# EAGLE design Down Linker ver1.0.0 (EAGLE 9.6.2)
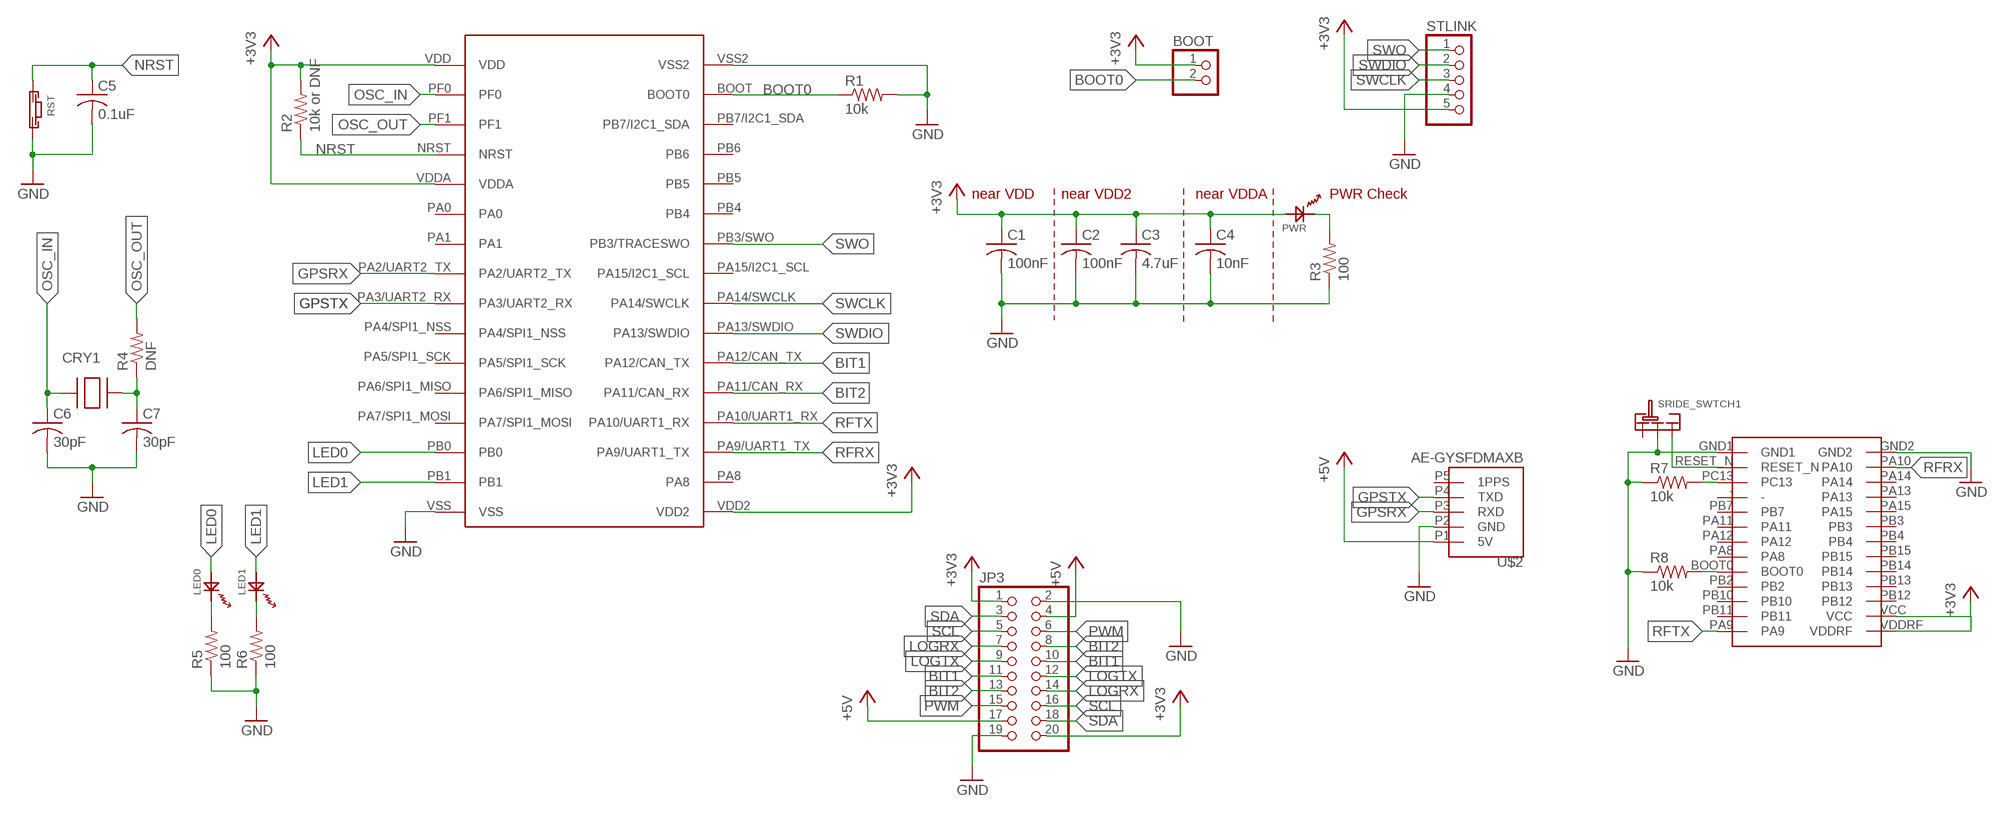
[diagram p0: schematic, sheet 1]

## Parts
BOOT  PINHD-1X2/90  [1X02/90]
C1  100nF  C-USC1608  [C1608]
C2  100nF  C-USC1608  [C1608]
C3  4.7uF  C-USC1608  [C1608]
C4  10nF  C-USC1608  [C1608]
C5  0.1uF  C-USC1608  [C1608]
C6  30pF  C-USC1608  [C1608]
C7  30pF  C-USC1608  [C1608]
CRY1  8MHZ  [CRYSTAL]
JP3  PINHD-2X10/90  [2X10/90]
LED0  OSXX1608C1A  [OSXX1608C1A]
LED1  OSXX1608C1A  [OSXX1608C1A]
PWR  OSXX1608C1A  [OSXX1608C1A]
R1  10k  R-US_R0603  [R0603]
R2  10k or DNF  R-US_R0603  [R0603]
R3  100  R-US_R0603  [R0603]
R4  DNF  R-US_R0603  [R0603]
R5  100  R-US_R0603  [R0603]
R6  100  R-US_R0603  [R0603]
R7  10k  R-US_R0603  [R0603]
R8  10k  R-US_R0603  [R0603]
RST  TVAF06-A020B-R  [TVAF06-A020B-R]
SRIDE_SWTCH1  SRIDE_SWITCH  [SRIDE_SWITCH]
STLINK  PINHD-1X5/90  [1X05/90]
U$1  STM32F303K8  [STM32F303K8]
U$2  AE-GYSFDMAXB  [AE-GYSFDMAXB]
U$3  RM-92A  [RM-92A]

## Nets
+3V3: BOOT.1 C1.1 C2.1 C3.1 C4.1 JP3.1 JP3.20 PWR.AN R2.2 STLINK.5 U$1.VDD U$1.VDD2 U$1.VDDA U$3.VCC U$3.VDDRF
+5V: JP3.4 JP3.17 U$2.P1(5V)
BIT1: JP3.10 JP3.11 U$1.PA12/CAN_TX
BIT2: JP3.8 JP3.13 U$1.PA11/CAN_RX
BOOT0: BOOT.2 R1.1 U$1.BOOT(BOOT0)
GND: C1.2 C2.2 C3.2 C4.2 C5.2 C6.2 C7.2 JP3.2 JP3.19 R1.2 R3.1 R5.1 R6.1 R7.1 R8.1 RST.P$2 SRIDE_SWTCH1.LR STLINK.4 U$1.VSS U$1.VSS2 U$2.P2(GND) U$3.GND1 U$3.GND2
GPSRX: U$1.PA2/UART2_TX U$2.P3(RXD)
GPSTX: U$1.PA3/UART2_RX U$2.P4(TXD)
LED0: LED0.AN U$1.PB0
LED1: LED1.AN U$1.PB1
LOGRX: JP3.7 JP3.14
LOGTX: JP3.9 JP3.12
N$1: PWR.CT R3.2
N$2: LED0.CT R5.2
N$3: C7.1 CRY1.P$2 R4.1
N$4: LED1.CT R6.2
N$6: SRIDE_SWTCH1.R U$3.RESET_N
N$9: R7.2 U$3.PC13
N$10: R8.2 U$3.BOOT0
NRST: C5.1 R2.1 RST.P$1 U$1.NRST
OSC_IN: C6.1 CRY1.P$1 U$1.PF0
OSC_OUT: R4.2 U$1.PF1
PWM: JP3.6 JP3.15
RFRX: U$1.PA9/UART1_TX U$3.PA10
RFTX: U$1.PA10/UART1_RX U$3.PA9
SCL: JP3.5 JP3.16
SDA: JP3.3 JP3.18
SWCLK: STLINK.3 U$1.PA14/SWCLK
SWDIO: STLINK.2 U$1.PA13/SWDIO
SWO: STLINK.1 U$1.PB3/SWO(PB3/TRACESWO)
Unconnected: SRIDE_SWTCH1.L U$1.PA0 U$1.PA1 U$1.PA4/SPI1_NSS U$1.PA5/SPI1_SCK U$1.PA6/SPI1_MISO U$1.PA7/SPI1_MOSI U$1.PA8 U$1.PA15/I2C1_SCL U$1.PB4 U$1.PB5 U$1.PB6 U$1.PB7/I2C1_SDA U$2.P5(1PPS) U$3.- U$3.PA8 U$3.PA11 U$3.PA12 U$3.PA13 U$3.PA14 U$3.PA15 U$3.PB2 U$3.PB3 U$3.PB4 U$3.PB7 U$3.PB10 U$3.PB11 U$3.PB12 U$3.PB13 U$3.PB14 U$3.PB15

## Notes on the sheet
- near VDD | near VDD2 | near VDDA | PWR Check

## Library data of the parts
BOOT = pinhead:PINHD-1X2: PIN HEADER
C1-C7 = rcl:C-US: CAPACITOR, American symbol; SPICEPREFIX: C
CRY1 = Crystal:8MHZ
JP3 = pinhead:PINHD-2X10: PIN HEADER
LED0 LED1 PWR = Chip LED:OSXX1608C1A
R1-R8 = rcl:R-US_: RESISTOR, American symbol; SPICEPREFIX: R
RST = Tact switch:TVAF06-A020B-R
SRIDE_SWTCH1 = Sride Switch:SRIDE_SWITCH
STLINK = pinhead:PINHD-1X5: PIN HEADER
U$1 = STM32F303K8:STM32F303K8
U$2 = AE-GYSFDMAXB:AE-GYSFDMAXB
U$3 = RM-92A:RM-92A

## Board
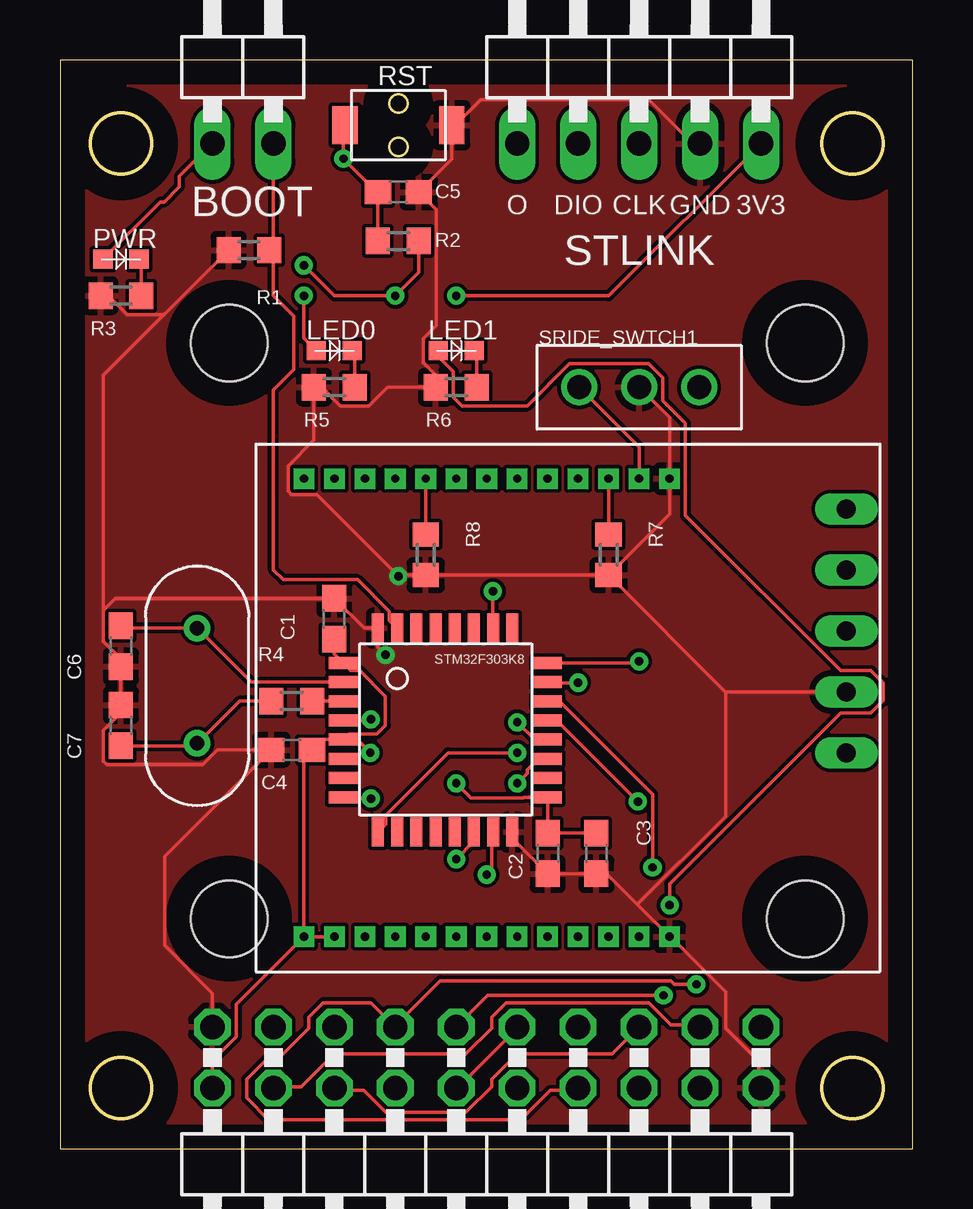
[diagram p1: board, top side]
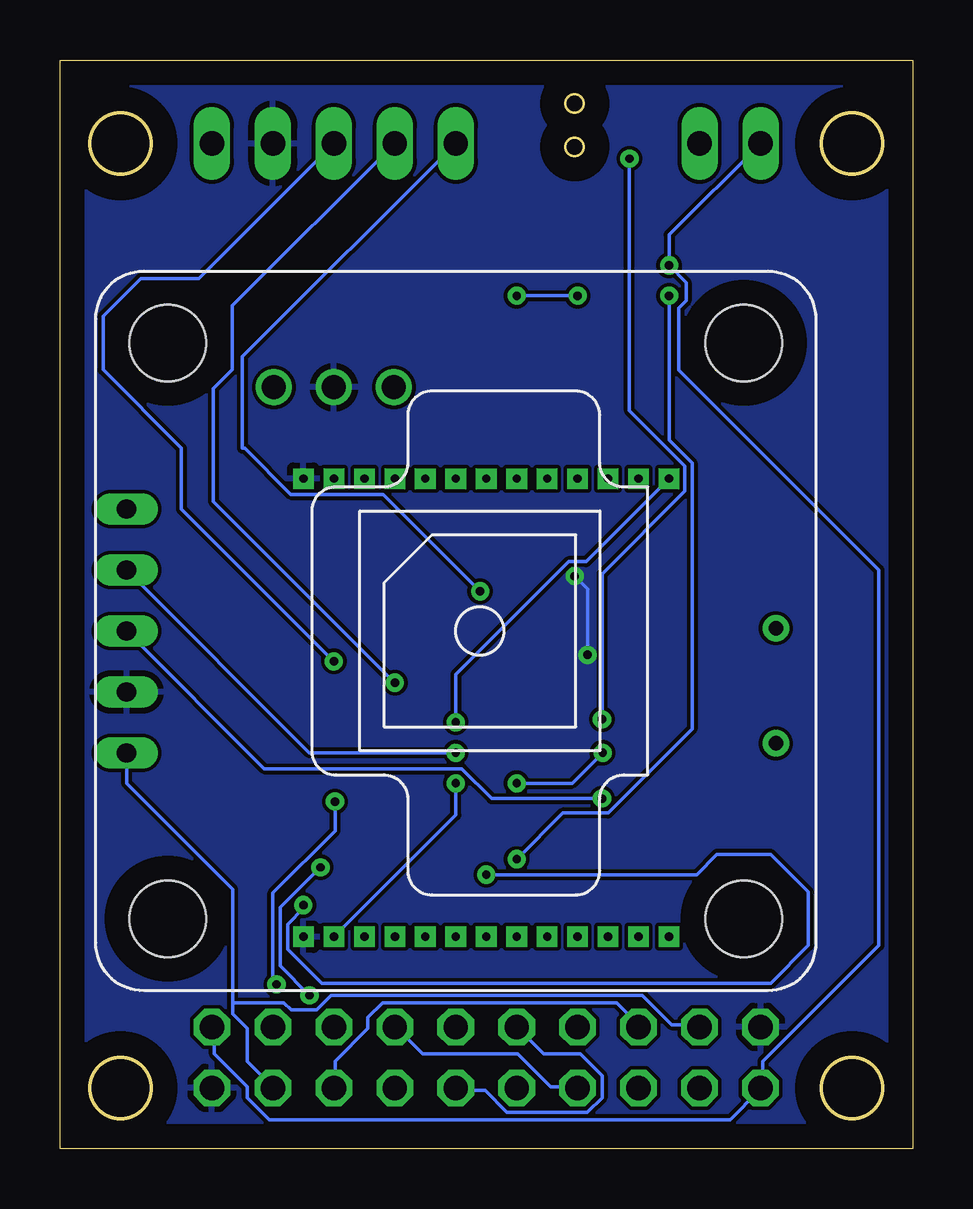
[diagram p2: board, bottom side, seen from below]

Size 35.54 x 45.39 mm. Coordinates in mm from the lower left corner, seen from the top.
Outline: 0,0 35.54,0 35.54,45.39 0,45.39 0,0
Outline: circle at 2.54,2.54 radius 1.27
Outline: circle at 33.02,2.54 radius 1.27
Outline: circle at 33.02,41.91 radius 1.27
Outline: circle at 2.54,41.91 radius 1.27
Copper layers (1*16): Top 0.035mm / dielectric 1.5mm / Bottom 0.035mm
Design rules "default": minimum track width 6mil, minimum drill 0.35mm, track to track 6mil, track to pad 6mil, pad to pad 6mil, via to via 6mil, smd to smd 6mil, copper to edge 40mil, drill to drill 6mil, minimum pad ring 10mil, minimum via ring 8mil, stop-mask expansion 4mil, vias tented up to drill 0mil, thermal gap 10mil

### Footprints (pad centres in the part's own frame; a part is rotated, then mirrored left to right if it is on the bottom)
1X02/90 = drill 1.016 long: 1 -1.27,-3.81; 2 1.27,-3.81
C1608 = smd 1.1 x 1: 1 -0.85,0; 2 0.85,0
CRYSTAL = drill 0.6: P$1 2.4,0; P$2 -2.4,0
2X10/90 = drill 1.016 octagon: 1 -11.43,-6.35; 2 -11.43,-3.81; 3 -8.89,-6.35; 4 -8.89,-3.81; 5 -6.35,-6.35; 6 -6.35,-3.81; 7 -3.81,-6.35; 8 -3.81,-3.81; 9 -1.27,-6.35; 10 -1.27,-3.81; 11 1.27,-6.35; 12 1.27,-3.81; 13 3.81,-6.35; 14 3.81,-3.81; 15 6.35,-6.35; 16 6.35,-3.81; 17 8.89,-6.35; 18 8.89,-3.81; 19 11.43,-6.35; 20 11.43,-3.81
OSXX1608C1A = smd 0.8 x 0.8: AN -0.75,0; CT 0.75,0
R0603 = smd 1 x 1.1: 1 -0.85,0; 2 0.85,0
TVAF06-A020B-R = smd 1.6 x 1.05: P$1 0,2.225; P$2 0,-2.225
SRIDE_SWITCH = drill 1: L -2.5,0; LR 0,0; R 2.5,0
1X05/90 = drill 1.016 long: 1 -5.08,-3.81; 2 -2.54,-3.81; 3 0,-3.81; 4 2.54,-3.81; 5 5.08,-3.81
STM32F303K8 = smd 0.5 x 1.2: BOOT 1.6,8.5; PA3/UART2_RX 0.8,0; PA4/SPI1_NSS 1.6,0; PA5/SPI1_SCK 2.4,0; PA6/SPI1_MISO 3.2,0; PA7/SPI1_MOSI 4,0; PA15/I2C1_SCL 6.4,8.5; PB0 4.8,0; PB1 5.6,0; PB3/SWO 5.6,8.5; PB4 4.8,8.5; PB5 4,8.5; PB6 3.2,8.5; PB7/I2C1_SDA 2.4,8.5; VSS 0.8,8.5; VSS2 6.4,0 | smd 1.2 x 0.5: NRST -0.65,4.65; PA0 -0.65,3.05; PA1 -0.65,2.25; PA2/UART2_TX -0.65,1.45; PA8 7.85,2.25; PA9/UART1_TX 7.85,3.05; PA10/UART1_RX 7.85,3.85; PA11/CAN_RX 7.85,4.65; PA12/CAN_TX 7.85,5.45; PA13/SWDIO 7.85,6.25; PA14/SWCLK 7.85,7.05; PF0 -0.65,6.25; PF1 -0.65,5.45; VDD -0.65,7.05; VDD2 7.85,1.45; VDDA -0.65,3.85
AE-GYSFDMAXB = drill 0.8 long: P1 13.716,5.08; P2 13.716,2.54; P3 13.716,0; P4 13.716,-2.54; P5 13.716,-5.08 | hole 3.2: -12,12; 12,12; 12,-12; -12,-12
RM-92A = drill 0.35 square: - 0,11.43; BOOT0 0,5.08; GND1 0,15.24; GND2 19.1,15.24; PA8 0,6.35; PA9 0,0; PA10 19.1,13.97; PA11 0,8.89; PA12 0,7.62; PA13 19.1,11.43; PA14 19.1,12.7; PA15 19.1,10.16; PB2 0,3.81; PB3 19.1,8.89; PB4 19.1,7.62; PB7 0,10.16; PB10 0,2.54; PB11 0,1.27; PB12 19.1,2.54; PB13 19.1,3.81; PB14 19.1,5.08; PB15 19.1,6.35; PC13 0,12.7; RESET_N 0,13.97; VCC 19.1,1.27; VDDRF 19.1,0

### Placement (x,y rotation side)
BOOT  7.62,45.72 0 top
C1  11.43,22.1 90 top
C2  20.32,12.32 270 top
C3  22.35,12.32 270 top
C4  9.65,16.64 180 top
C5  14.1,39.88 0 top
C6  2.54,20.95 270 top
C7  2.54,17.65 90 top
CRY1  5.71,19.3 90 top
JP3  17.78,-1.27 180 top
LED0  11.43,33.27 0 top
LED1  16.51,33.27 0 top
PWR  2.54,37.08 0 top
R1  7.87,37.47 180 top
R2  14.1,37.85 0 top
R3  2.54,35.56 0 top
R4  9.65,18.67 0 top
R5  11.43,31.75 0 top
R6  16.51,31.75 0 top
R7  22.86,24.77 90 top
R8  15.24,24.77 90 top
RST  14.1,42.67 90 top
SRIDE_SWTCH1  24.13,31.75 180 top
STLINK  24.13,45.72 0 top
U$1  12.45,13.21 0 top
U$2  19.05,21.59 180 bottom
U$3  10.16,27.94 270 top

### Tracks (layer width: path | path; a pad name or v marks a point on that pad's centre or on a via)
+3V3  (via drill 0.35)
  Top 0.152: U$1.VDDA 10.92,17.06 C4.1 10.16,16.3 U$3.VDDRF | BOOT.1 4.98,40.54 4.98,40.11 4.34,39.47 4.18,39.47 PWR.AN | U$1.VDDA 12.04,17.3 13.21,17.3 13.56,17.66 13.56,18.87 12.49,19.94 12.12,19.94 U$1.VDD 11.43,20.62 C1.1 | C3.1 C2.1 20.32,14.63 U$1.VDD2 19.33,14.66 19.3,14.63 17.12,14.63 v16.51,15.24 | U$3.VDDRF U$3.VCC | U$3.VDDRF 7.34,6.02 7.34,4.67 6.35,3.68 JP3.20 | v10.16,36.83 11.43,35.56 v13.97,35.56 14.95,36.54 R2.2 | STLINK.5 22.86,35.56 v16.51,35.56 | v12.93,16.51 12.38,17.06 U$1.VDDA
  Bottom 0.152: v16.51,15.24 14.2,15.24 v12.93,16.51 | BOOT.1 10.16,38.1 v10.16,36.83 9.45,36.12 9.45,35.36 9.75,35.05 9.75,32.46 1.42,24.13 1.42,8.48 6.25,3.66 6.25,2.59 JP3.20 6.4,2.44 7.62,1.22 26.82,1.22 27.74,2.13 27.74,2.59 29.11,3.96 29.11,5.03 JP3.1 | v16.51,35.56 v13.97,35.56
+5V
  Bottom 0.152: U$2.P1 32.77,15.24 28.35,10.82 28.35,6.1 | 28.35,6.1 28.35,5.64 27.74,5.03 27.74,3.66 26.67,2.59 JP3.4 | 28.35,6.1 26.21,6.1 25.91,5.79 24.84,5.79 24.23,6.4 11.28,6.4 10.06,5.18 8.99,5.18 JP3.17
BIT1  (via drill 0.35)
  Top 0.152: v24.69,11.73 24.69,14.78 20.88,18.59 20.42,18.59 U$1.PA12/CAN_TX | v25.15,6.4 17.83,6.4 JP3.11
  Bottom 0.152: v24.69,11.73 26.36,10.06 26.36,7.62 v25.15,6.4 | JP3.11 15.39,3.96 13.87,3.96 12.95,3.05 12.95,2.13 13.56,1.52 16.92,1.52 17.83,2.44 19.05,2.44 JP3.10
BIT2  (via drill 0.35)
  Top 0.152: v24.08,14.48 20.73,17.83 20.42,17.83 U$1.PA11/CAN_RX | v26.52,6.86 25.6,6.86 25.45,7.01 15.85,7.01 14.02,5.18 JP3.13 12.95,6.1 10.97,6.1 10.36,5.49 10.36,5.03 9.3,3.96 8.84,3.96 7.77,2.9 7.77,2.13 8.69,1.22 19.2,1.22 20.42,2.44 21.49,2.44 JP3.8
  Bottom 0.152: v24.08,14.48 24.08,13.26 26.67,10.67 26.67,7.01 v26.52,6.86
BOOT0
  Top 0.152: BOOT.2 8.89,37.63 | 8.89,37.63 R1.1 | 8.89,37.63 8.89,35.56 9.74,34.7 9.74,32.48 8.89,31.62 8.89,24.13 9.29,23.73 12.4,23.73 13.72,22.4 13.72,22.03 U$1.BOOT
GND  (via drill 0.35)
  Top 0.152: 1.81,22.45 2.31,22.95 C1.2 12.67,21.71 U$1.VSS | R3.1 2.02,35.56 2.79,34.78 4.34,34.78 R1.2 1.81,32.25 1.81,22.45 | U$1.VSS 13.25,22.08 | U$1.VSS2 18.85,12.94 C2.2 C3.2 22.77,11.47 24.05,10.19 | U$1.VSS 13.25,20.91 v13.56,20.59 | R7.1 R8.1 14.14,23.91 v14.1,23.88 10.69,27.28 9.64,27.28 9.5,27.42 9.5,28.46 10.58,29.54 R5.1 10.91,31.75 11.69,30.97 12.88,30.97 13.65,31.75 R6.1 15.66,32.25 15.13,32.78 15.13,33.77 15.68,34.31 15.68,39.15 C5.2 16.32,41.25 RST.P$2 16.46,42.67 17.53,43.74 24.54,43.74 26.36,41.91 STLINK.4 | 1.81,22.45 1.81,21.16 2.54,20.43 C6.2 C7.2 2.54,18.18 1.81,17.45 1.81,16.16 1.95,16.02 5.94,16.02 6.55,16.64 C4.2 4.36,12.19 4.36,8.47 6.35,6.48 JP3.19 | SRIDE_SWTCH1.LR 25.4,30.48 U$3.GND1 25.4,26.45 R7.1 | U$2.P2 27.74,19.05 | R7.1 27.72,19.05 27.74,19.05 | 24.05,10.19 U$3.GND2 25.45,8.84 27.74,6.55 27.74,5.03 29.11,3.66 29.11,2.59 JP3.2 | 24.05,10.19 27.74,13.87 27.74,19.05
  Bottom 0.152: v13.56,20.59 13.56,23.34 v14.1,23.88
  pour Top: -1.27,45.72 36.83,45.72 36.83,-1.27 -1.27,-1.27
  pour Bottom: -1.27,45.72 36.83,45.72 36.83,-1.27 -1.27,-1.27
GPSRX  (via drill 0.35)
  Top 0.152: v12.95,14.61 11.85,14.61 U$1.PA2/UART2_TX
  Bottom 0.152: U$2.P3 27.02,15.85 18.8,15.85 17.56,14.61 v12.95,14.61
GPSTX  (via drill 0.35)
  Top 0.152: U$1.PA3/UART2_RX 13.57,13.53 13.57,13.9 16.18,16.51 v19.05,16.51
  Bottom 0.152: v19.05,16.51 25.15,16.51 U$2.P4
LED0  (via drill 0.35)
  Top 0.152: LED0.AN 10.16,33.79 v10.16,35.56 | v16.51,12.08 17.25,12.81 U$1.PB0
  Bottom 0.152: v10.16,35.56 10.16,29.55 9.2,28.59 9.2,17.5 12.7,14 14.59,14 v16.51,12.08
LED1  (via drill 0.35)
  Top 0.152: LED1.AN 15.76,33.02 16.39,32.4 16.39,31.35 16.77,30.97 19.46,30.97 21.22,32.73 24.54,32.73 25.11,32.16 25.11,31.2 26.06,30.25 26.06,26.4 32.52,19.93 33.79,19.93 34.3,19.42 34.3,18.68 33.79,18.17 32.52,18.17 25.4,11.05 v25.4,10.16 | U$1.PB1 17.98,13.11 17.98,11.58 17.83,11.43 v17.78,11.43
  Bottom 0.152: v25.4,10.16 25.4,10.02 26.06,9.36 26.06,8.32 24.64,6.9 5.94,6.9 4.36,8.47 4.36,10.71 5.94,12.28 8.17,12.28 9.02,11.43 v17.78,11.43
LOGRX
  Bottom 0.152: JP3.14 14.02,2.59 15.09,2.59 16.46,3.96 20.42,3.96 21.49,5.03 JP3.7
LOGTX
  Top 0.152: JP3.12 16.61,2.59 19.05,5.03 JP3.9
N$1
  Top 0.152: PWR.CT 3.39,36.98 R3.2
N$2
  Top 0.152: LED0.CT 12.28,33.17 R5.2
N$3
  Top 0.152: R4.1 7.48,18.67 CRY1.P$2 5.61,16.8 C7.1
N$4
  Top 0.152: LED1.CT 17.36,33.17 R6.2
N$6
  Top 0.152: U$3.RESET_N 24.13,29.25 SRIDE_SWTCH1.R
N$9
  Top 0.152: R7.2 U$3.PC13
N$10
  Top 0.152: R8.2 U$3.BOOT0
NRST  (via drill 0.35)
  Top 0.152: U$1.NRST 12.91,17.86 v12.95,17.91 | RST.P$1 11.81,42.61 v11.81,41.27 13.21,39.88 C5.1 R2.1
  Bottom 0.152: v12.95,17.91 12.95,23.96 9.5,27.42 9.5,28.46 11.81,30.77 v11.81,41.27
OSC_IN
  Top 0.152: U$1.PF0 7.96,19.46 CRY1.P$1 2.64,21.7 C6.1
OSC_OUT
  Top 0.152: R4.2 11.79,18.67 U$1.PF1
PWM
  Bottom 0.152: JP3.6 24.08,2.59 24.08,3.66 22.71,5.03 22.71,5.49 22.1,6.1 12.34,6.1 11.43,5.18 JP3.15
RFRX  (via drill 0.35)
  Top 0.152: v19.05,15.24 19.47,15.66 19.47,15.8 19.92,16.26 U$1.PA9/UART1_TX
  Bottom 0.152: U$3.PA10 19.05,13.92 v19.05,15.24
RFTX  (via drill 0.35)
  Top 0.152: v19.05,17.78 19.77,17.06 U$1.PA10/UART1_RX
  Bottom 0.152: U$3.PA9 13.62,24.48 14.35,24.48 19.05,19.78 v19.05,17.78
SCL
  Top 0.152: JP3.5 23.01,3.96 19.05,3.96 17.98,2.9 17.98,2.59 16.92,1.52 13.56,1.52 12.65,2.44 11.43,2.44 JP3.16
SDA
  Top 0.152: JP3.18 8.99,2.59 10.06,2.59 11.43,3.96 16.92,3.96 17.98,5.03 17.98,5.49 18.59,6.1 24.54,6.1 25.45,5.18 26.67,5.18 JP3.3
SWCLK  (via drill 0.35)
  Top 0.152: v24.13,20.32 24.07,20.26 U$1.PA14/SWCLK
  Bottom 0.152: STLINK.3 29.76,36.28 32.16,36.28 33.74,34.7 33.74,32.48 30.48,29.21 30.48,26.67 v24.13,20.32
SWDIO  (via drill 0.35)
  Top 0.152: v21.59,19.43 20.32,19.43 U$1.PA13/SWDIO
  Bottom 0.152: STLINK.2 28.36,35.14 28.36,32.48 29.15,31.69 29.15,26.99 v21.59,19.43
SWO  (via drill 0.35)
  Top 0.152: v18.03,23.24 18.03,21.72 U$1.PB3/SWO
  Bottom 0.152: STLINK.1 27.94,33.02 27.94,29.21 27.85,29.21 25.92,27.28 22.07,27.28 v18.03,23.24

### Text on the board
tPlace: O | DIO | CLK | GND | 3V3